# EAGLE design SensorIoT_Node_Programmer (EAGLE 9.4.0)
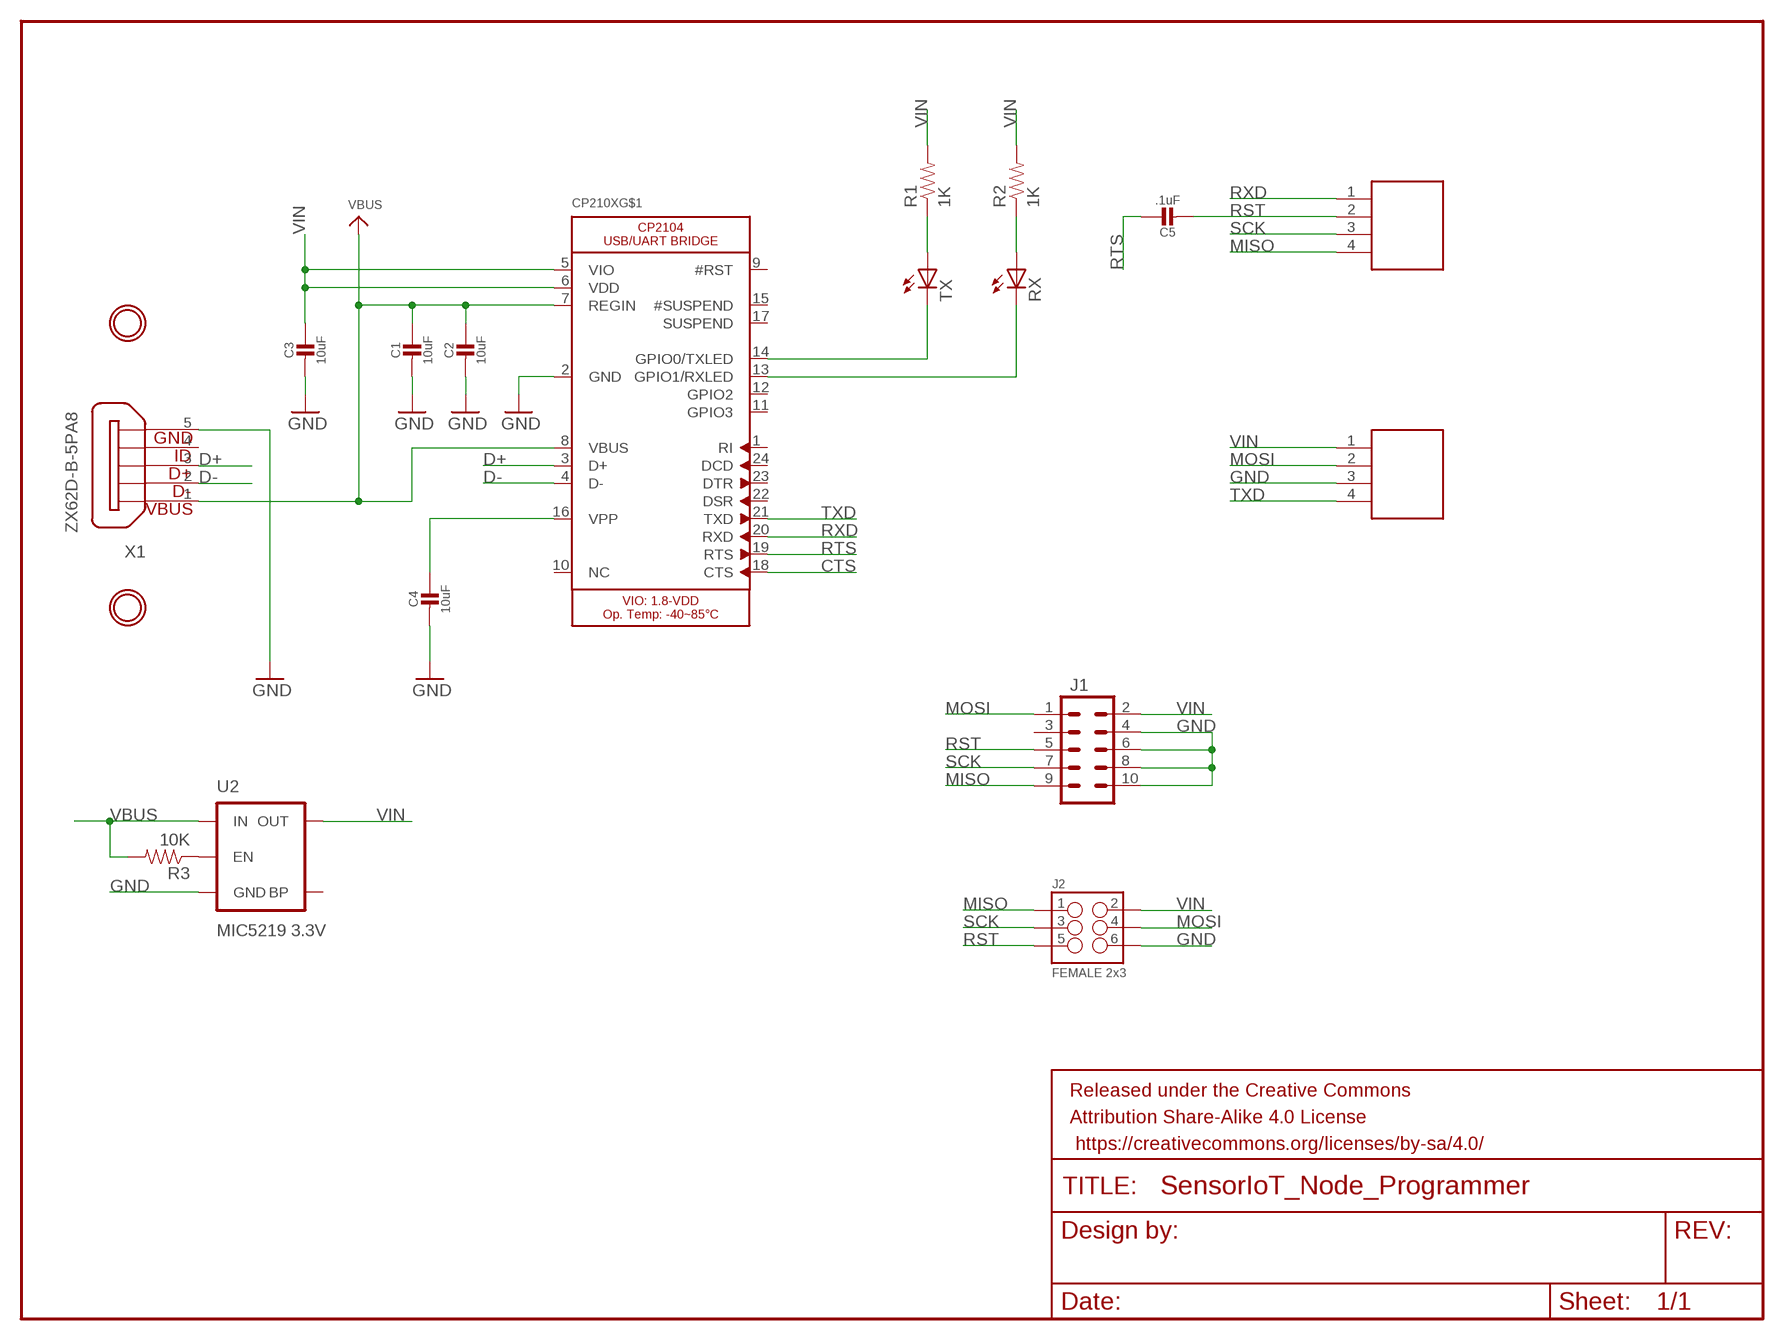
[diagram p0: schematic, sheet 1]

## Parts
C1  10uF  CAP_CERAMIC_0805  [_0805]
C2  10uF  CAP_CERAMIC_0805  [_0805]
C3  10uF  CAP_CERAMIC_0805  [_0805]
C4  10uF  CAP_CERAMIC_0805  [_0805]
C5  .1uF  CAP_CERAMIC_0805  [_0805]
CP210X  CP2104  [QFN24_4MM_SMSC]
FRAME1  FRAME-LETTER  [CREATIVE_COMMONS]
J1  M05X2PTH  [AVR_ICSP]
J2  FEMALE 2x3  M03X2FEMALE  [2X3]
R1  1K  RESISTOR0805-RES  [0805]
R2  1K  RESISTOR0805-RES  [0805]
R3  10K  RESISTOR0805-RES  [0805]
RX  LEDCHIP-LED0805  [CHIP-LED0805]
TX  LEDCHIP-LED0805  [CHIP-LED0805]
U2  MIC5219 3.3V  V_REG_MIC52193.3V  [SOT23-5]
U$2  MOUNTINGHOLE2.0  [MOUNTINGHOLE_2.0_PLATED]
U$3  MOUNTINGHOLE2.0  [MOUNTINGHOLE_2.0_PLATED]
U$4  4X.1IN_POGO_PIN  [4X.1IN_POGO_PIN]
U$5  4X.1IN_POGO_PIN  [4X.1IN_POGO_PIN]
X1  ZX62D-B-5PA8  [ZX62D-B-5PA8]

## Nets
CTS: CP210X.18(CTS)
D+: CP210X.3(D+) X1.3
D-: CP210X.4(D-) X1.2
GND: C1.2 C2.2 C3.2 C4.2 CP210X.2(GND) J1.4 J1.6 J1.8 J1.10 J2.6 U2.2(GND) U$5.3 X1.5
MISO: J1.9 J2.1 U$4.4
MOSI: J1.1 J2.4 U$5.2
N$1: C4.1 CP210X.16(VPP)
N$2: CP210X.14(GPIO0/TXLED) TX.C
N$3: R3.1 U2.3(EN)
N$5: CP210X.13(GPIO1/RXLED) RX.C
N$6: R1.1 TX.A
N$7: R2.1 RX.A
RST: C5.2 J1.5 J2.5 U$4.2
RTS: C5.1 CP210X.19(RTS)
RXD: CP210X.20(RXD) U$4.1
SCK: J1.7 J2.3 U$4.3
TXD: CP210X.21(TXD) U$5.4
VBUS: C1.1 C2.1 CP210X.7(REGIN) CP210X.8(VBUS) R3.2 U2.1(IN) X1.1
VIN: C3.1 CP210X.5(VIO) CP210X.6(VDD) J1.2 J2.2 R1.2 R2.2 U2.5(OUT) U$5.1
Unconnected: CP210X.1(RI) CP210X.9(#RST) CP210X.10(NC) CP210X.11(GPIO3) CP210X.12(GPIO2) CP210X.15(#SUSPEND) CP210X.17(SUSPEND) CP210X.22(DSR) CP210X.23(DTR) CP210X.24(DCD) J1.3 U2.4(BP) X1.4 X1.S1 X1.S2 X1.S3 X1.S4

## Power pins joined to a net without a drawn wire
TP: CP210X.THERM(TP)

## Library data of the parts
C1-C5 = Adafruit CP2104 Friend:CAP_CERAMIC: Ceramic Capacitors For new designs, use the packages preceded by an '_' character since they are more reliable: The following footprints should be used on most boards: _0402 - Standard footprint for regular board layouts _0603 - Standard footprint for regular board layouts _0805 - Standard footprint for regular board layouts _1206 - Standard footprint for regular board layouts For extremely tight-pitch boards where space is at a premium, the following 'micro-pitch' footprints can be used (smaller pads, no silkscreen outline, etc.): _0402MP - Micro-pitch footprint for very dense/compact boards _0603MP - Micro-pitch footprint for very dense/compact boards _0805MP - Micro-pitch footprint for very dense/compact boards _1206MP - Micro-pitch footprint for very dense/compact boards
CP210X = Adafruit CP2104 Friend:CP2104: CP2104 - USB to UART Bridge VDD Output: 3.45V
FRAME1 = SparkFun-Aesthetics:FRAME-LETTER: Schematic Frame Standard 8.5x11 US Letter frame
J1 = SparkFun-Connectors:M05X2: Header 5x2 Standard 10-pin dual row 0.1" header. Commonly used with AVR-ISP. Use with Spark Fun Electronics SKU: PRT-00778
J2 = SparkFun-Connectors:M03X2: 2x3 .1" header. Shrouded, with keying- CONN-10681 SMT- CONN-11415 Pogo pins- HW-11044; PROD_ID: CONN-11566
R1-R3 = SparkFun-Passives:RESISTOR: Resistor Basic schematic elements and footprints for 0603, 1206, and PTH resistors.
RX TX = adafruit:LED: LED OSRAM: - CHIPLED LG R971, LG N971, LY N971, LG Q971, LY Q971, LO R971, LY R971 LH N974, LH R974 LS Q976, LO Q976, LY Q976 LO Q996 - Hyper CHIPLED LW Q18S LB Q993, LB Q99A, LB R99A - SideLED LS A670, LO A670, LY A670, LG A670, LP A670 LB A673, LV A673, LT A673, LW A673 LH A674 LY A675 LS A676, LA A676, LO A676, LY A676, LW A676 LS A679, LY A679, LG A679 - Hyper Micro SIDELED® LS Y876, LA Y876, LO Y876, LY Y876 LT Y87S - SmartLED LW L88C, LW L88S LB L89C, LB L89S, LG L890 LS L89K, LO L89K, LY L89K LS L896, LA L896, LO L896, LY L896 - TOPLED LS T670, LO T670, LY T670, LG T670, LP T670 LSG T670, LSP T670, LSY T670, LOP T670, LYG T670 LG T671, LOG T671, LSG T671 LB T673, LV T673, LT T673, LW T673 LH T674 LS T676, LA T676, LO T676, LY T676, LB T676, LH T676, LSB T676, LW T676 LB T67C, LV T67C, LT T67C, LS T67K, LO T67K, LY T67K, LW E67C LS E67B, LA E67B, LO E67B, LY E67B, LB E67C, LV E67C, LT E67C LW T67C LS T679, LY T679, LG T679 LS T770, LO T770, LY T770, LG T770, LP T770 LB T773, LV T773, LT T773, LW T773 LH T774 LS E675, LA E675, LY E675, LS T675 LS T776, LA T776, LO T776, LY T776, LB T776 LHGB T686 LT T68C, LB T68C - Hyper Mini TOPLED® LB M676 - Mini TOPLED Santana® LG M470 LS M47K, LO M47K, LY M47K Source: http://www.osram.convergy.de/
U2 = SparkFun-PowerIC:V_REG_MIC5219: V_REG MIC5219 Standard 3.3V and 5V 500mA LDO voltage regulator in SOT-23 layout. Micrel part MIC5219. BP (by-pass) pin is used to lower output noise with 470pF cap, may be left open.; PROD_ID: VREG-09872
U$2 U$3 = microbuilder:MOUNTINGHOLE: Mounting Hole For #2 screws (0.086"/2.18mm width, 0.094"/2.4mm hole) use 2.5mm
U$4 U$5 = GDTech:4X.1IN_POGO_PIN: 4x.1in spacing 1.02mm diameter pogo pins P75-B1 Dia 1.02mm 100g Spring Test Probe Pogo Pin found on eBay.
X1 = GDTech:ZX62D-B-5PA8: Micro USB Type B Connector - Standard, Shell Through Hole Source: http://www.hirose.co.jp/cataloge_hp/ed_ZX_20140804.pdf; MF: Hirose; MPN: ZX62D-B-5PA8; OC_FARNELL: 2300438; OC_NEWARK: 69W0712

## Board
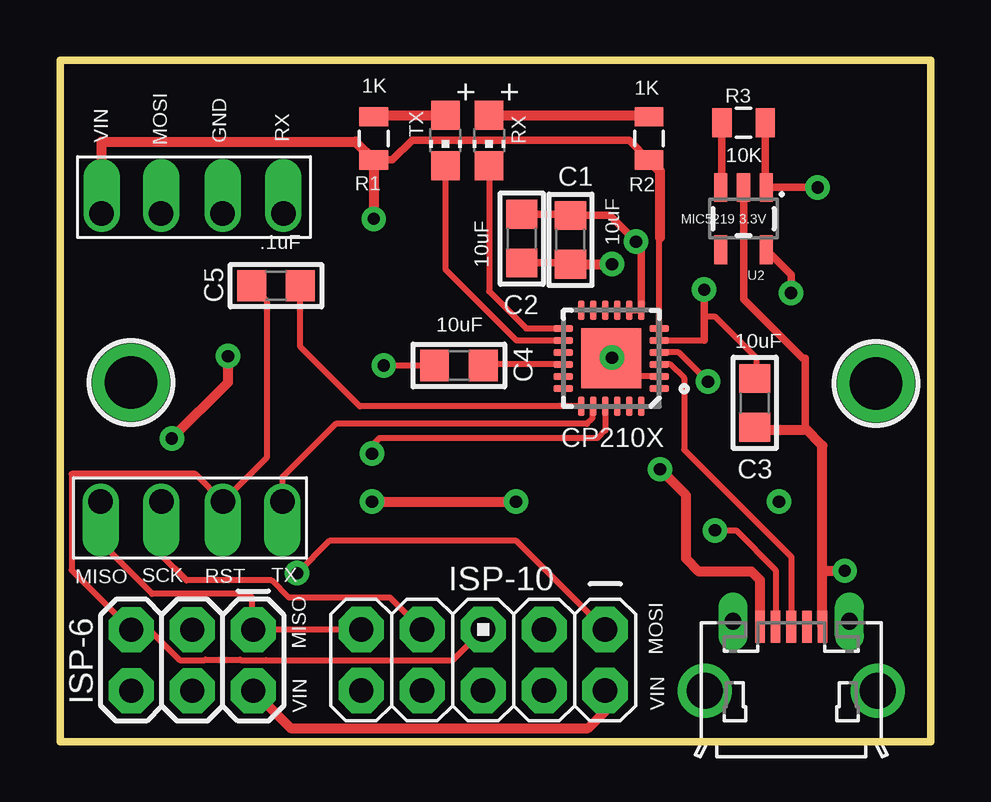
[diagram p1: board, top side]
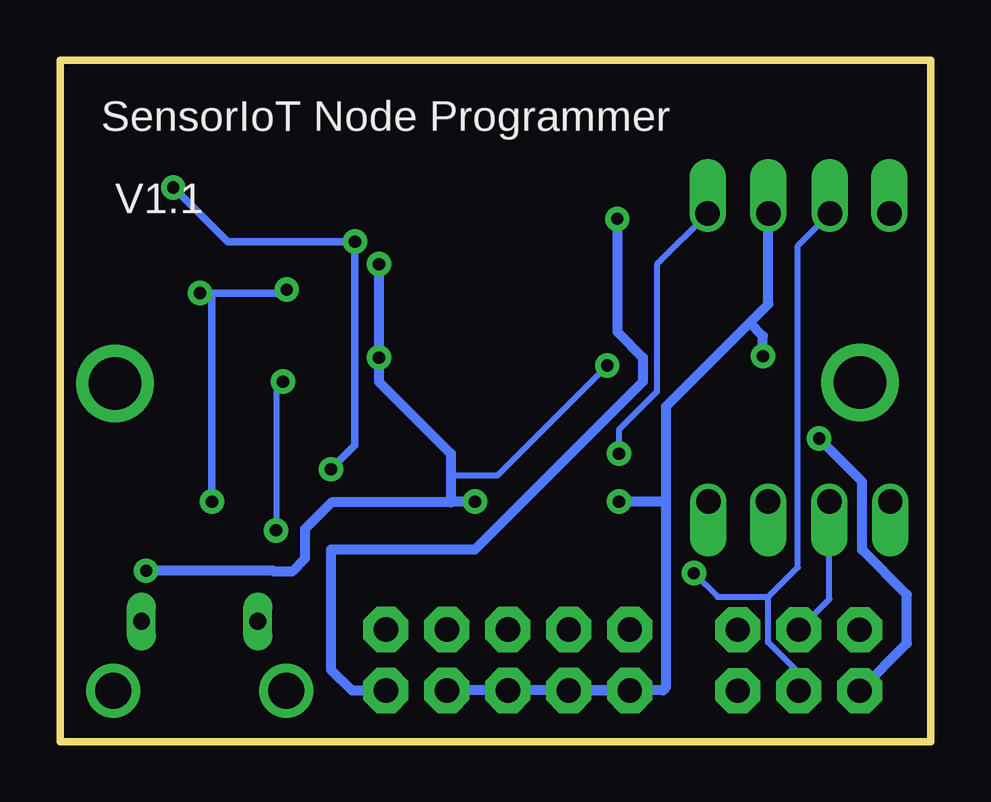
[diagram p2: board, bottom side, seen from below]

Size 36.29 x 28.4 mm. Coordinates in mm from the lower left corner, seen from the top.
Outline: 0,0 36.29,0 36.29,28.4 0,28.4 0,0
Copper layers (1*16): Top 0.035mm / dielectric 1.5mm / Bottom 0.035mm
Design rules "SparkFun-2-layer-STANDARD": minimum track width 10mil, minimum drill 20mil, track to track 10mil, track to pad 8mil, pad to pad 8mil, via to via 10mil, smd to smd 8mil, copper to edge 8mil, drill to drill 8mil, minimum pad ring 10mil, minimum via ring 10mil, stop-mask expansion 4mil, vias tented up to drill 25mil, thermal gap 10mil

### Footprints (pad centres in the part's own frame; a part is rotated, then mirrored left to right if it is on the bottom)
_0805 = smd 1.2 x 1.3: 1 -1.016,0; 2 1.016,0
QFN24_4MM_SMSC = smd 0.8 x 0.28: 1 -2,1.25; 2 -2,0.75; 3 -2,0.25; 4 -2,-0.25; 5 -2,-0.75; 6 -2,-1.25; 13 2,-1.25; 14 2,-0.75; 15 2,-0.25; 16 2,0.25; 17 2,0.75; 18 2,1.25 | smd 0.28 x 0.8: 7 -1.25,-2; 8 -0.75,-2; 9 -0.25,-2; 10 0.25,-2; 11 0.75,-2; 12 1.25,-2; 19 1.25,2; 20 0.75,2; 21 0.25,2; 22 -0.25,2; 23 -0.75,2; 24 -1.25,2 | smd 2.5 x 2.5: THERM 0,0
AVR_ICSP = drill 1.016 pad 1.88 octagon: 1 -1.27,5.08; 2 1.27,5.08; 3 -1.27,2.54; 4 1.27,2.54; 5 -1.27,0; 6 1.27,0; 7 -1.27,-2.54; 8 1.27,-2.54; 9 -1.27,-5.08; 10 1.27,-5.08
2X3 = drill 1.016 pad 1.88 octagon: 1 0,0; 2 0,2.54; 3 2.54,0; 4 2.54,2.54; 5 5.08,0; 6 5.08,2.54
0805 = smd 0.8 x 1.2: 1 -0.9,0; 2 0.9,0
CHIP-LED0805 = smd 1.2 x 1.2: A 0,-1.05; C 0,1.05
SOT23-5 = smd 0.55 x 1.2: 1 -0.95,-1.3; 2 0,-1.3; 3 0.95,-1.3; 4 0.95,1.3; 5 -0.95,1.3
MOUNTINGHOLE_2.0_PLATED = drill 2.2 pad 3: P$1 0,0
4X.1IN_POGO_PIN = drill 1.016 pad 1.422 offset: 1 0,9.27; 2 0,6.787; 3 0,4.229; 4 0,1.695
ZX62D-B-5PA8 = smd 1.35 x 0.4: 1 4.825,1.3; 2 4.825,0.65; 3 4.825,0; 4 4.825,-0.65; 5 4.825,-1.3 | drill 1.5: S1 2.15,-3.6; S2 2.15,3.6 | drill 0.7 long: S3 5.05,2.425; S4 5.05,-2.425

### Placement (x,y rotation side)
C1  21.27,20.91 270 top
C2  19.24,20.96 270 top
C3  28.95,14.11 270 top
C4  16.62,15.67 180 top
C5  9,19 180 top
CP210X  22.97,15.97 180 top
FRAME1  0.4,-12.49 0 top  (outside the outline)
J1  17.63,3.4 270 top
J2  8.05,4.66 180 top
R1  13.07,25.14 270 top
R2  24.54,25.13 270 top
R3  28.48,25.79 0 top
RX  17.88,25.05 180 top
TX  16.06,25.05 180 top
U2  28.48,21.79 180 top
U$2  2.96,14.96 0 top
U$3  34,14.92 0 top
U$4  0,10 270 top
U$5  11,22 90 top
X1  30.47,-0.04 90 top

### Tracks (layer width: path | path; a pad name or v marks a point on that pad's centre or on a via)
D+
  Top 0.254: CP210X.3 25.44,15.72 26,15.16 26,12.17 30.47,7.7 X1.3 | CP210X.3
D-  (via drill 0.51)
  Top 0.254: X1.2 29.82,7.15 28.17,8.8 v27.29,8.8 | v27,15 25.78,16.22 CP210X.4
  Bottom 0.254: v27,15 27.29,14.71 v27.29,8.8
GND  (via drill 0.51)
  Top 0.254: v23,16 23,15 23.22,15.22 CP210X.2 | C4.2 v13.49,15.67
  Top 0.305: C1.2 21.22,19.94 C2.2 | U2.2 28.48,18.44 30.94,15.98 31.05,15.98 31.05,13.05 31,13
  Top 0.406: C3.2 29.04,13 31,13 | C1.2 v23,19.89 | X1.5 31.77,7.1 | 31.77,7.1 31.77,12.33 31.05,13.05 | v32.7,7.12 32.68,7.1 31.77,7.1 | v13,10 v19,10 | v4.66,12.63 7,14.97 v7,16.06
  Bottom 0.254: v13.49,15.67 18.08,11.08 20,11.08
  Bottom 0.406: v23,19.89 v23,16 23,15 20,12 20,11.08 20,9.97 | 20,9.97 24.97,9.97 26.09,8.85 26.09,7.62 26.62,7.09 27.38,7.09 27.41,7.12 v32.7,7.12 | J1.10 J1.6 J1.4 | J1.8 J1.10 | J1.10 11.17,2.13 11.03,2.27 11.03,10 | U$5.3 6.77,18.23 7.55,17.45 | 11.03,10 11.03,13.97 7.55,17.45 | 11.03,10 v13,10 | v19,10 19.97,10 20,9.97 | J2.6 1,4.09 1,6.13 2.86,7.99 2.86,10.82 v4.67,12.63 v4.66,12.63 | v7,16.06 7,16.89 7.55,17.45
MISO
  Top 0.254: U$4.4 1.7,8.3 3.84,6.16 7.84,6.16 8,6 8,4.71 J2.1 J1.9
MOSI  (via drill 0.51)
  Top 0.254: J1.1 19.02,8.36 11.22,8.36 v9.88,7.02
  Bottom 0.254: J2.4 5.51,2.86 6.78,4.13 6.78,6.03 | 6.78,6.03 5.55,7.26 5.55,20.66 U$5.2 | v9.88,7.02 8.89,6.03 6.78,6.03
N$1
  Top 0.254: CP210X.16 17.69,15.72 C4.1
N$2
  Top 0.254: CP210X.14 19.02,16.71 16.06,19.68 TX.C
N$3
  Top 0.305: R3.1 27.58,23.14 U2.3
N$5
  Top 0.254: RX.C 17.88,18.76 19.42,17.22 CP210X.13
N$6
  Top 0.406: R1.1 13.13,26.1 TX.A
N$7
  Top 0.406: RX.A 24.47,26.1 R2.1
RST
  Top 0.254: C5.2 8.61,18.38 8.61,11.82 U$4.2 5.63,11.16 0.48,11.16 0.48,7.15 J2.5 3.71,4.66 4.98,3.39 6.04,3.39 6.07,3.42 7.49,3.42 7.52,3.39 8.58,3.39 8.59,3.4 16.36,3.4 J1.5
RTS
  Top 0.254: CP210X.19 12.49,13.97 10.02,16.44 C5.1
RXD
  Top 0.254: CP210X.20 22.19,13.94 22.19,13.47 21.96,13.24 11.49,13.24 9.27,11.02 U$4.1
SCK
  Top 0.254: U$4.3 4.23,7.77 5.28,6.72 8.82,6.72 9.54,6 13.76,6 J1.7
  Bottom 0.254: J2.3 4.23,5.94 U$4.3
TXD  (via drill 0.51)
  Top 0.254: CP210X.21 22.72,12.97 22.4,12.65 13.31,12.65 13,12.34 v13,12
  Bottom 0.254: v13,12 13,12.98 11.42,14.57 11.42,19.89 U$5.4
VBUS  (via drill 0.51)
  Top 0.254: CP210X.8 CP210X.7
  Top 0.305: CP210X.7 24.22,20.61 v24,20.83 22.91,21.93 C1.1 21.22,21.98 C2.1 | R3.2 29.38,23.14 U2.1 v31.57,23.09
  Top 0.406: X1.1 29.17,6.73 28.81,7.09 26.62,7.09 26.09,7.62 26.09,10.26 v25,11.35
  Bottom 0.305: v25,11.35 24,12.35 v24,20.83 29.31,20.83 v31.57,23.09
VIN  (via drill 0.51)
  Top 0.254: 26.84,16.72 CP210X.5 CP210X.6 24.97,20.97 25,21 | 26.84,17.72 27.28,17.72 29,16 29,15.18 C3.1
  Top 0.305: U2.5 30.46,19.46 v30.46,18.69 | v26.84,18.83 26.84,17.72 26.84,16.72 | R2.2 23.71,25.06 14.67,25.06 13.85,24.24 R1.2
  Top 0.406: R2.2 25,23.77 25,21 | U$5.1 1.73,25 12.31,25 R1.2 v13.07,21.78 | J2.2 9.61,0.56 22,0.56 22.71,1.27 J1.2
  Bottom 0.305: v30.46,18.69 30,18.69 | 30,18.69 26.84,18.69 v26.84,18.83 | v29.96,10 29.96,18.65 30,18.69
  Bottom 0.406: v13.07,21.78 13.07,17.07 12,16 12,15 19,8 25,8 25,3 24.13,2.13 J1.2

### Text on the board
tPlace: VIN | MOSI | GND | RX | MISO | SCK | RST | TX | ISP-10 | MISO | MOSI | ISP-6 | VIN | VIN
bPlace: SensorIoT Node Programmer | V1.1